# EAGLE design zero-tiny-ble (EAGLE 7.2.0)
ATTiny85 + HM-10 Bluetooth 4.0 LE
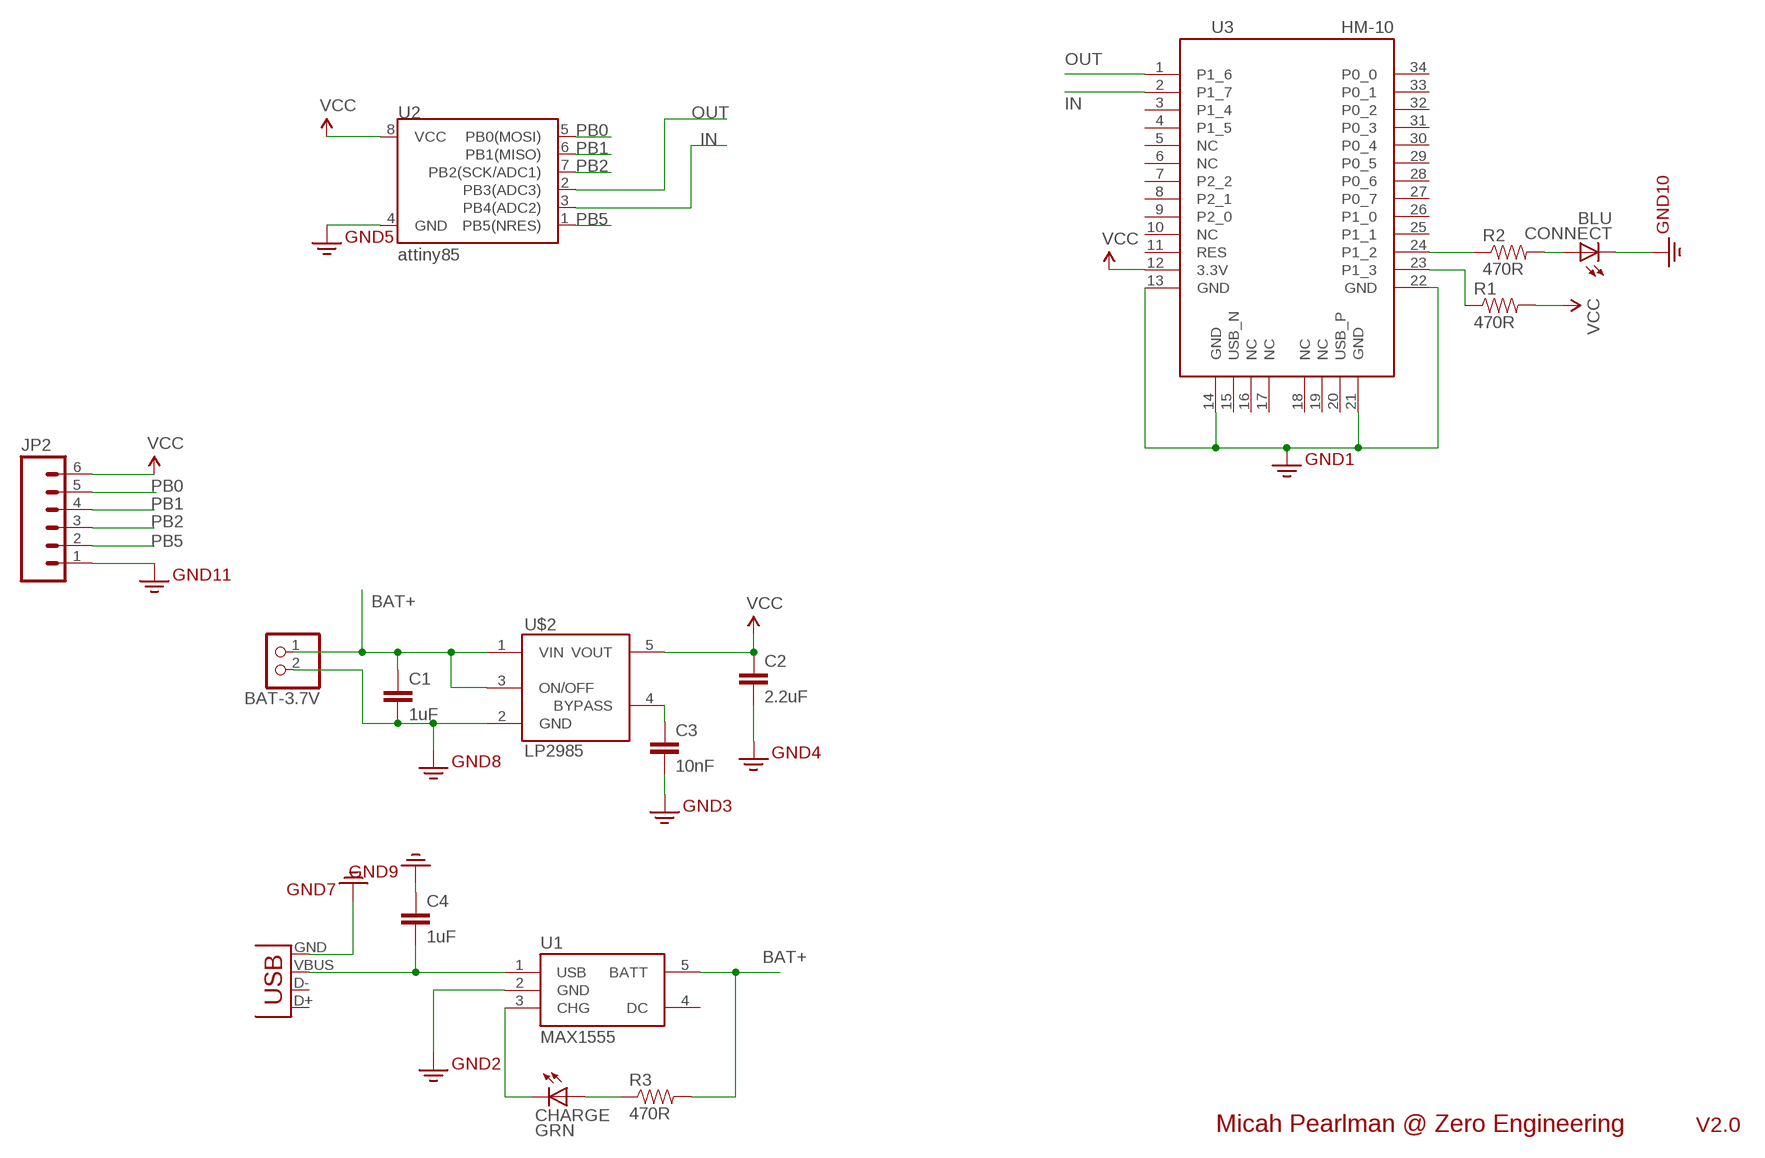
[diagram p0: schematic, sheet 1]

## Parts
BAT-3.7V  JST_2PIN-THM  [JST-PH-2-THM]
C1  1uF  1UF-25V-10%(0805)  [0805]
C2  2.2uF  2.2UF-25V-+80/-20(0805)  [0805]
C3  10nF  CAP0805  [0805]
C4  1uF  1UF-25V-10%(0805)  [0805]
CHARGE  GRN  LEDCHIPLED_0805  [CHIPLED_0805]
CONNECT  BLU  LEDCHIPLED_0805  [CHIPLED_0805]
JP1  USB-SMD-NS  [USB-MINIB-NOSTOP]
JP2  M06SILK_FEMALE_PTH  [1X06]
R1  470R  0.3OHM-1/8W-1%(0805)  [0805]
R2  470R  0.3OHM-1/8W-1%(0805)  [0805]
R3  470R  0.3OHM-1/8W-1%(0805)  [0805]
U1  MAX1555  [SOT23-5]
U2  attiny85  ATTINY45TINY85-20-DIP  [DIP08]
U3  HM-10  [HM-10]
U$2  LP2985AIM5-3.3  [SOT25]

## Nets
3.3V: BAT-3.7V.2 C1.2 C2.2 C3.2 C4.1 CONNECT.C JP1.GND JP2.1 U1.2(GND) U2.4(GND) U3.13(GND) U3.14(GND) U3.21(GND) U3.22(GND) U$2.2(GND) ; supply symbol labelled GND2
BAT+: BAT-3.7V.1 C1.1 R3.2 U1.5(BATT) U$2.1(VIN) U$2.3(ON/OFF)
BYPASS: C3.1 U$2.4(BYPASS)
IN: U2.3(PB4(ADC2)) U3.2(P1_7)
N$1: CHARGE.A R3.1
N$2: C4.2 JP1.VBUS U1.1(USB)
N$3: CHARGE.C U1.3(CHG)
N$14: R2.1 U3.24(P1_2)
N$15: R1.1 U3.23(P1_3)
N$16: CONNECT.A R2.2
OUT: U2.2(PB3(ADC3)) U3.1(P1_6)
PB0: JP2.5 U2.5(PB0(MOSI))
PB1: JP2.4 U2.6(PB1(MISO))
PB2: JP2.3 U2.7(PB2(SCK/ADC1))
PB5: JP2.2 U2.1(PB5(NRES))
VCC: C2.1 JP2.6 R1.2 U2.8(VCC) U3.12(3.3V) U$2.5(VOUT)
Unconnected: JP1.D+ JP1.D- U1.4(DC) U3.3(P1_4) U3.4(P1_5) U3.5(NC) U3.6(NC) U3.7(P2_2) U3.8(P2_1) U3.9(P2_0) U3.10(NC) U3.11(RES) U3.15(USB_N) U3.16(NC) U3.17(NC) U3.18(NC) U3.19(NC) U3.20(USB_P) U3.25(P1_1) U3.26(P1_0) U3.27(P0_7) U3.28(P0_6) U3.29(P0_5) U3.30(P0_4) U3.31(P0_3) U3.32(P0_2) U3.33(P0_1) U3.34(P0_0)

## Notes on the sheet
- Micah Pearlman @ Zero Engineering | V2.0

## Library data of the parts
BAT-3.7V = adafruit:JST_2PIN: JST 2-Pin Connectors of various flavors SMT-RA (S2B-PH-SM4) 4UConnector #17311 SMT (B2B-PH-SM4) THM-RA (S2B-PH) THM (B2B-PH)
C1 C4 = SparkFun-Capacitors:1UF-25V-10%(0805): CAP-08064; PROD_ID: CAP-08064
C2 = SparkFun-Capacitors:2.2UF-25V-+80/-20(0805): CAP-11624; PROD_ID: CAP-11624
C3 = SparkFun-Passives:CAP: Capacitor Standard 0603 ceramic capacitor, and 0.1" leaded capacitor.
CHARGE CONNECT = adafruit:LED: LED OSRAM: - CHIPLED LG R971, LG N971, LY N971, LG Q971, LY Q971, LO R971, LY R971 LH N974, LH R974 LS Q976, LO Q976, LY Q976 LO Q996 - Hyper CHIPLED LW Q18S LB Q993, LB Q99A, LB R99A - SideLED LS A670, LO A670, LY A670, LG A670, LP A670 LB A673, LV A673, LT A673, LW A673 LH A674 LY A675 LS A676, LA A676, LO A676, LY A676, LW A676 LS A679, LY A679, LG A679 - Hyper Micro SIDELED® LS Y876, LA Y876, LO Y876, LY Y876 LT Y87S - SmartLED LW L88C, LW L88S LB L89C, LB L89S, LG L890 LS L89K, LO L89K, LY L89K LS L896, LA L896, LO L896, LY L896 - TOPLED LS T670, LO T670, LY T670, LG T670, LP T670 LSG T670, LSP T670, LSY T670, LOP T670, LYG T670 LG T671, LOG T671, LSG T671 LB T673, LV T673, LT T673, LW T673 LH T674 LS T676, LA T676, LO T676, LY T676, LB T676, LH T676, LSB T676, LW T676 LB T67C, LV T67C, LT T67C, LS T67K, LO T67K, LY T67K, LW E67C LS E67B, LA E67B, LO E67B, LY E67B, LB E67C, LV E67C, LT E67C LW T67C LS T679, LY T679, LG T679 LS T770, LO T770, LY T770, LG T770, LP T770 LB T773, LV T773, LT T773, LW T773 LH T774 LS E675, LA E675, LY E675, LS T675 LS T776, LA T776, LO T776, LY T776, LB T776 LHGB T686 LT T68C, LB T68C - Hyper Mini TOPLED® LB M676 - Mini TOPLED Santana® LG M470 LS M47K, LO M47K, LY M47K Source: http://www.osram.convergy.de/
JP1 = SparkFun-Connectors:USB: USB Connectors USB-B-PTH is fully proven SKU : PRT-00139/CONN-08278 USB-miniB is fully proven SKU : PRT-00587 USB-A-PCB is untested. USB-A-H is throughly reviewed, but untested. Spark Fun Electronics SKU : PRT-00437 USB-B-SMT is throughly reviewed, but untested. Needs silkscreen touching up. USB-A-S has not been used/tested USB-MB-H has not been used/tested USB-MICROB has been used. CONN-09505
JP2 = SparkFun-Connectors:M06: Header 6 Standard 6-pin 0.1" header. Use with straight break away headers (SKU : PRT-00116), right angle break away headers (PRT-00553), swiss pins (PRT-00743), machine pins (PRT-00117), and female headers (PRT-00115). Molex polarized connector foot print use with SKU : PRT-08094 with associated crimp pins and housings. NOTES ON THE VARIANTS LOCK and LOCK_LONGPADS... This footprint was designed to help hold the alignment of a through-hole component (i.e. 6-pin header) while soldering it into place. You may notice that each hole has been shifted either up or down by 0.005 of an inch from it's more standard position (which is a perfectly straight line). This slight alteration caused the pins (the squares in the middle) to touch the edges of the holes. Because they are alternating, it causes a "brace" to hold the component in place. 0.005 has proven to be the perfect amount of "off-center" position when using our standard breakaway headers. Although looks a little odd when you look at the bare footprint, once you have a header in there, the alteration is very hard to notice. Also,if you push a header all the way into place, it is covered up entirely on the bottom side. This idea of altering the position of holes to aid alignment will be further integrated into the Sparkfun Library for other footprints. It can help hold any component with 3 or more connection pins.; PROD_ID: CONN-08437
R1-R3 = SparkFun-Resistors:0.3OHM-1/8W-1%(0805); PROD_ID: RES-11622; VALUE: 0.3
U1 = SparkFun-PowerIC:MAX1555: MAX1555 Lithium Charger IC SOT-23 Lithium Polymer charging IC. Schematic element and footprint proven. Spark Fun Electronics SKU : COM-00674
U2 = SparkFun-DigitalIC:ATTINY45: Atmel 8-pin 2/4/8kB flash uC; PROD_ID: IC-09445; VALUE: TINY85-20-DIP
U3 = HM-10_BLE:HM-10
U$2 = LP2985:LP2985: LP2985-N Micropower 150 mA Low-Noise Ultra Low-Dropout Regulator

## Board
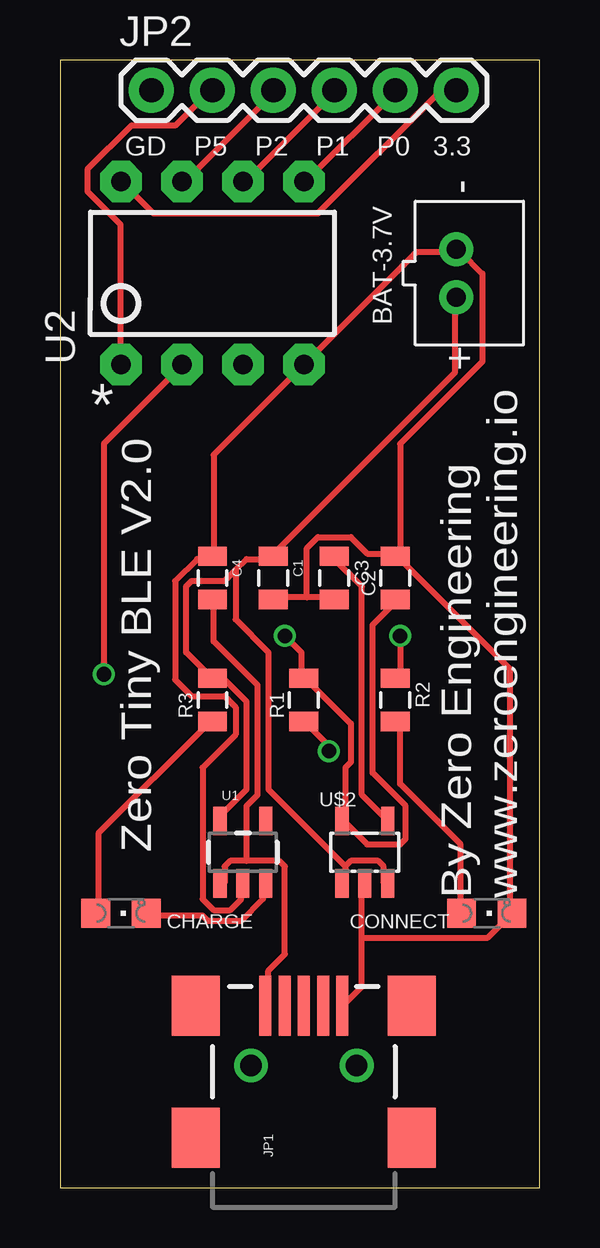
[diagram p1: board, top side]
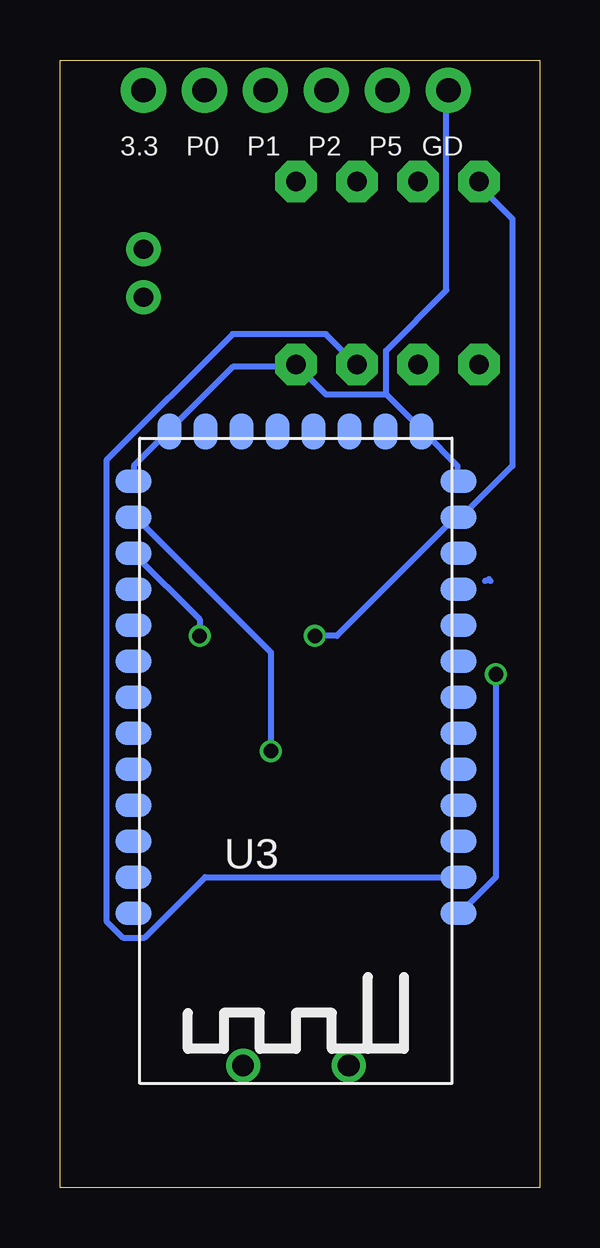
[diagram p2: board, bottom side, seen from below]

Size 19.99 x 46.98 mm. Coordinates in mm from the lower left corner, seen from the top.
Outline: 0,0 19.99,0 19.99,46.98 0,46.98 0,0
Copper layers (1*16): Top 0.035mm / dielectric 1.5mm / Bottom 0.035mm
Design rules "SeeedStudio_2layer_DRU_no_angle_20140221": minimum track width 6mil, minimum drill 12mil, track to track 6mil, track to pad 6mil, pad to pad 6mil, via to via 6mil, smd to smd 0mil, copper to edge 10mil, drill to drill 10mil, minimum pad ring 10mil, minimum via ring 6mil, stop-mask expansion 2mil, vias tented up to drill 100mil, thermal gap 10mil

### Footprints (pad centres in the part's own frame; a part is rotated, then mirrored left to right if it is on the bottom)
JST-PH-2-THM = drill 0.8 pad 1.422: 1 1,0; 2 -1,0
0805 = smd 0.8 x 1.2: 1 -0.9,0; 2 0.9,0
CHIPLED_0805 = smd 1.2 x 1.2: A 0,-1.05; C 0,1.05
USB-MINIB-NOSTOP = smd 2.5 x 0.5: D+ 2.5,0; D- 2.5,0.8; GND 2.5,-1.6; ID 2.5,-0.8; VBUS 2.5,1.6 | smd 2.5 x 2: G1 -3,-4.5; G2 -3,4.5; G3 2.5,4.5; G4 2.5,-4.5 | drill 0.9 pad 0.8: H1 0,2.2 | drill 0.9 pad 0.787: H2 0,-2.2
1X06 = drill 1.016 pad 1.88: 1 0,0; 2 2.54,0; 3 5.08,0; 4 7.62,0; 5 10.16,0; 6 12.7,0
SOT23-5 = smd 0.55 x 1.2: 1 -0.95,-1.3; 2 0,-1.3; 3 0.95,-1.3; 4 0.95,1.3; 5 -0.95,1.3
DIP08 = drill 0.813 pad 1.727 octagon: 1 -3.81,-3.81; 2 -1.27,-3.81; 3 1.27,-3.81; 4 3.81,-3.81; 5 3.81,3.81; 6 1.27,3.81; 7 -1.27,3.81; 8 -3.81,3.81
HM-10 = smd 1.5 x 1: 1 -6.77,6.35; 2 -6.77,4.85; 3 -6.77,3.35; 4 -6.77,1.85; 5 -6.77,0.35; 6 -6.77,-1.15; 7 -6.77,-2.65; 8 -6.77,-4.15; 9 -6.77,-5.65; 10 -6.77,-7.15; 11 -6.77,-8.65; 12 -6.77,-10.15; 13 -6.77,-11.65; 22 6.77,-11.65; 23 6.77,-10.15; 24 6.77,-8.65; 25 6.77,-7.15; 26 6.77,-5.65; 27 6.77,-4.15; 28 6.77,-2.65; 29 6.77,-1.15; 30 6.77,0.35; 31 6.77,1.85; 32 6.77,3.35; 33 6.77,4.85; 34 6.77,6.35 | smd 1 x 1.5: 14 -5.23,-13.72; 15 -3.73,-13.72; 16 -2.23,-13.72; 17 -0.73,-13.72; 18 0.77,-13.72; 19 2.27,-13.72; 20 3.77,-13.72; 21 5.27,-13.72
SOT25 = smd 0.55 x 1.2: 1 -0.95,-1.3; 2 0,-1.3; 3 0.95,-1.3; 4 0.95,1.3; 5 -0.95,1.3

### Placement (x,y rotation side)
BAT-3.7V  16.51,38.1 270 top
C1  8.89,25.4 270 top
C2  13.97,25.4 90 top
C3  11.43,25.4 270 top
C4  6.35,25.4 270 top
CHARGE  2.54,11.43 270 top
CONNECT  17.78,11.43 270 top
JP1  10.16,5.08 90 top
JP2  3.81,45.72 0 top
R1  10.16,20.32 90 top
R2  13.97,20.32 270 top
R3  6.35,20.32 90 top
U1  7.62,13.97 0 top
U2  6.35,38.1 0 top
U3  10.16,17.78 180 bottom
U$2  12.7,13.97 0 top

### Tracks (layer width: path | path; a pad name or v marks a point on that pad's centre or on a via)
3.3V
  Top 0.254: 12.57,10.41 12.57,8.36 11.89,7.67 JP1.GND | 12.57,10.41 12.57,12.47 U$2.2 | 12.57,10.41 17.83,10.41 18.75,11.33 CONNECT.C 18.75,11.56 18.75,21.61 14.17,26.19 C2.2 | 10.29,24.59 11.43,24.59 C3.2 | 10.29,24.59 8.91,24.59 C1.2 | 10.29,24.59 10.29,26.64 10.74,27.1 12.12,27.1 12.8,26.42 13.95,26.42 C2.2 | U1.2 7.54,12.47 7.54,12.01 7.09,11.56 6.4,11.56 5.94,12.01 5.94,17.5 7.32,18.87 7.32,20.02 6.86,20.47 5.49,20.47 4.8,21.16 4.8,25.27 5.71,26.19 6.17,26.19 C4.1 6.4,26.42 6.4,30.53 U2.4 14.86,38.99 16.46,38.99 BAT-3.7V.2 16.69,38.99 17.6,38.08 17.6,34.42 14.17,30.99 14.17,26.42 C2.2
  Bottom 0.254: U3.13 3.43,29.62 3.43,30.07 4.8,31.45 U3.14 5.03,31.67 6.4,33.05 | U3.22 16.92,29.62 16.92,30.07 15.54,31.45 U3.21 15.32,31.67 12.8,34.19 10.29,34.19 U2.4 8.91,33.05 6.4,33.05 | 3.89,37.39 3.89,45.62 | 3.89,37.39 6.4,34.87 6.4,33.05 | 3.89,45.62 JP2.1 | 3.89,37.39 3.89,45.62
BAT+
  Top 0.254: 11.89,13.39 11.89,12.7 U$2.1 | 11.89,13.39 12.12,13.61 13.26,13.61 13.49,13.39 13.49,12.7 U$2.3 | U1.5 6.63,15.44 7.77,16.59 7.77,20.24 6.86,21.16 6.4,21.16 R3.2 6.17,21.39 5.26,22.3 5.26,25.04 5.49,25.27 6.86,25.27 7.32,25.73 | 7.32,25.73 7.77,26.19 8.69,26.19 C1.1 8.91,26.42 16.46,33.96 16.46,36.93 BAT-3.7V.1 | 11.89,13.39 8.69,16.59 8.69,22.3 7.32,23.67 7.32,25.73
BYPASS
  Top 0.254: C3.1 11.43,26.19 12.57,25.04 12.57,16.36 13.49,15.44 U$2.4
GND
  Bottom 0.254: 2.29,25.27 2.11,25.35 2.06,25.27
IN
  Bottom 0.254: U3.2 3.43,12.93 13.95,12.93 16.46,10.41 17.37,10.41 18.06,11.1 18.06,30.3 12.8,35.56 8.91,35.56 7.77,34.42 U2.3
N$1
  Top 0.254: CHARGE.A 1.6,11.56 1.6,14.76 6.17,19.33 R3.1
N$2
  Top 0.254: 7.77,13.61 9.14,13.61 9.37,13.39 9.37,9.73 8.69,9.04 8.69,7.67 JP1.VBUS | 7.77,13.61 7.09,13.61 6.86,13.39 6.86,12.7 U1.1 | 7.77,13.61 7.77,15.9 8.23,16.36 8.23,20.93 6.4,22.76 6.4,24.36 C4.2
N$3
  Top 0.254: CHARGE.C 3.66,11.33 5.94,11.33 6.17,11.1 7.54,11.1 8.46,12.01 8.46,12.47 U1.3
N$14  (via drill 0.61)
  Top 0.254: v14.17,22.99 14.17,21.39 R2.1
  Bottom 0.254: v14.17,22.99 14.17,23.67 16.92,26.42 U3.24
N$15  (via drill 0.61)
  Top 0.254: v11.2,18.19 11.2,18.41 10.29,19.33 R1.1
  Bottom 0.254: v11.2,18.19 11.2,22.3 16.92,28.02 U3.23
N$16
  Top 0.254: R2.2 14.17,19.33 14.17,16.82 16.69,14.3 16.69,11.56 CONNECT.A
OUT  (via drill 0.61)
  Top 0.254: v1.83,21.39 1.83,30.99 5.03,34.19 U2.2
  Bottom 0.254: v1.83,21.39 1.83,12.93 3.2,11.56 U3.1
PB0
  Top 0.254: U2.5 10.29,41.96 13.95,45.62 JP2.5
PB1
  Top 0.254: U2.6 7.77,41.96 11.43,45.62 JP2.4
PB2
  Top 0.254: U2.7 5.26,41.96 8.91,45.62 JP2.3
PB5
  Top 0.254: U2.1 2.52,34.42 2.52,40.13 1.14,41.5 1.14,42.42 2.97,44.25 4.8,44.25 6.17,45.62 JP2.2
VCC  (via drill 0.61)
  Top 0.254: C2.1 13.95,24.36 13.03,23.44 13.03,17.27 14.4,15.9 14.4,14.53 14.17,14.3 12.8,14.3 11.89,15.21 U$2.5 11.89,15.44 11.89,17.5 12.12,17.73 12.12,19.33 10.29,21.16 R1.2 10.06,21.39 10.06,22.3 v9.37,22.99 | JP2.6 16.46,45.62 15.77,45.62 10.74,40.59 3.89,40.59 2.74,41.73 U2.8
  Bottom 0.254: U2.8 2.52,41.73 1.14,40.36 1.14,30.07 3.2,28.02 U3.12 3.43,28.02 8.46,22.99 v9.37,22.99

### Text on the board
_tsilk: GD | P5 | P2 | P1 | P0 | 3.3 | * | Zero Tiny BLE V2.0 | By Zero Engineering / www.zeroengineering.io
_bsilk: GD | P5 | P2 | P1 | P0 | 3.3